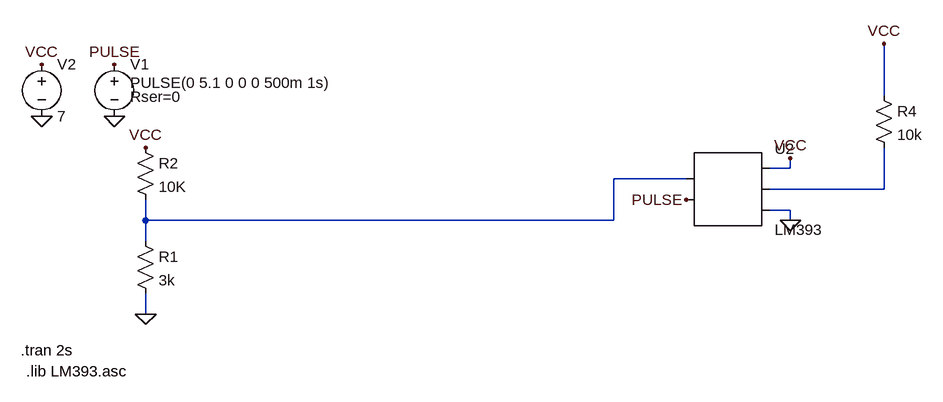
[diagram p0: schematic LM393.asc]
LM393.asc, the LTspice schematic file:
Version 4
SHEET 1 1236 680
WIRE 1104 -16 1104 -96
WIRE 960 96 960 80
WIRE 960 96 928 96
WIRE 800 112 688 112
WIRE 1104 128 1104 64
WIRE 1104 128 928 128
WIRE 960 160 928 160
WIRE -32 176 -32 144
WIRE 688 176 688 112
WIRE 688 176 -32 176
WIRE 960 176 960 160
WIRE -32 208 -32 176
WIRE -32 320 -32 288
FLAG -80 16 0
FLAG -192 16 0
FLAG -192 -64 VCC
FLAG -80 -64 PULSE
FLAG -32 64 VCC
FLAG -32 320 0
FLAG 800 144 PULSE
FLAG 960 80 VCC
FLAG 1104 -96 VCC
FLAG 960 176 0
SYMBOL res -48 192 R0
SYMATTR InstName R1
SYMATTR Value 3k
SYMBOL res -48 48 R0
SYMATTR InstName R2
SYMATTR Value 10K
SYMBOL voltage -80 -80 R0
WINDOW 3 24 44 Left 2
WINDOW 123 0 0 Left 0
WINDOW 39 24 66 Left 2
SYMATTR Value PULSE(0 5.1 0 0 0 500m 1s)
SYMATTR SpiceLine Rser=0
SYMATTR InstName V1
SYMBOL voltage -192 -80 R0
SYMATTR InstName V2
SYMATTR Value 7
SYMBOL res 1088 -32 R0
SYMATTR InstName R4
SYMATTR Value 10k
SYMBOL AutoGenerated/LM393 864 128 R0
SYMATTR InstName U2
TEXT -224 376 Left 2 !.tran 2s
TEXT -216 408 Left 2 !.lib LM393.asc

The netlist it stands for:
* LM393.asc
R1 N001 0 3k
R2 VCC N001 10K
V1 PULSE 0 PULSE(0 5.1 0 0 0 500m 1s) Rser=0
V2 VCC 0 7
R4 VCC N002 10k
* U2: LM393 (symbol AutoGenerated/LM393 not available, pins judged from their places): pin1=N001 pin2=PULSE pin3=VCC pin4=N002 pin5=0
.tran 2s
.lib LM393.asc
.backanno
.end